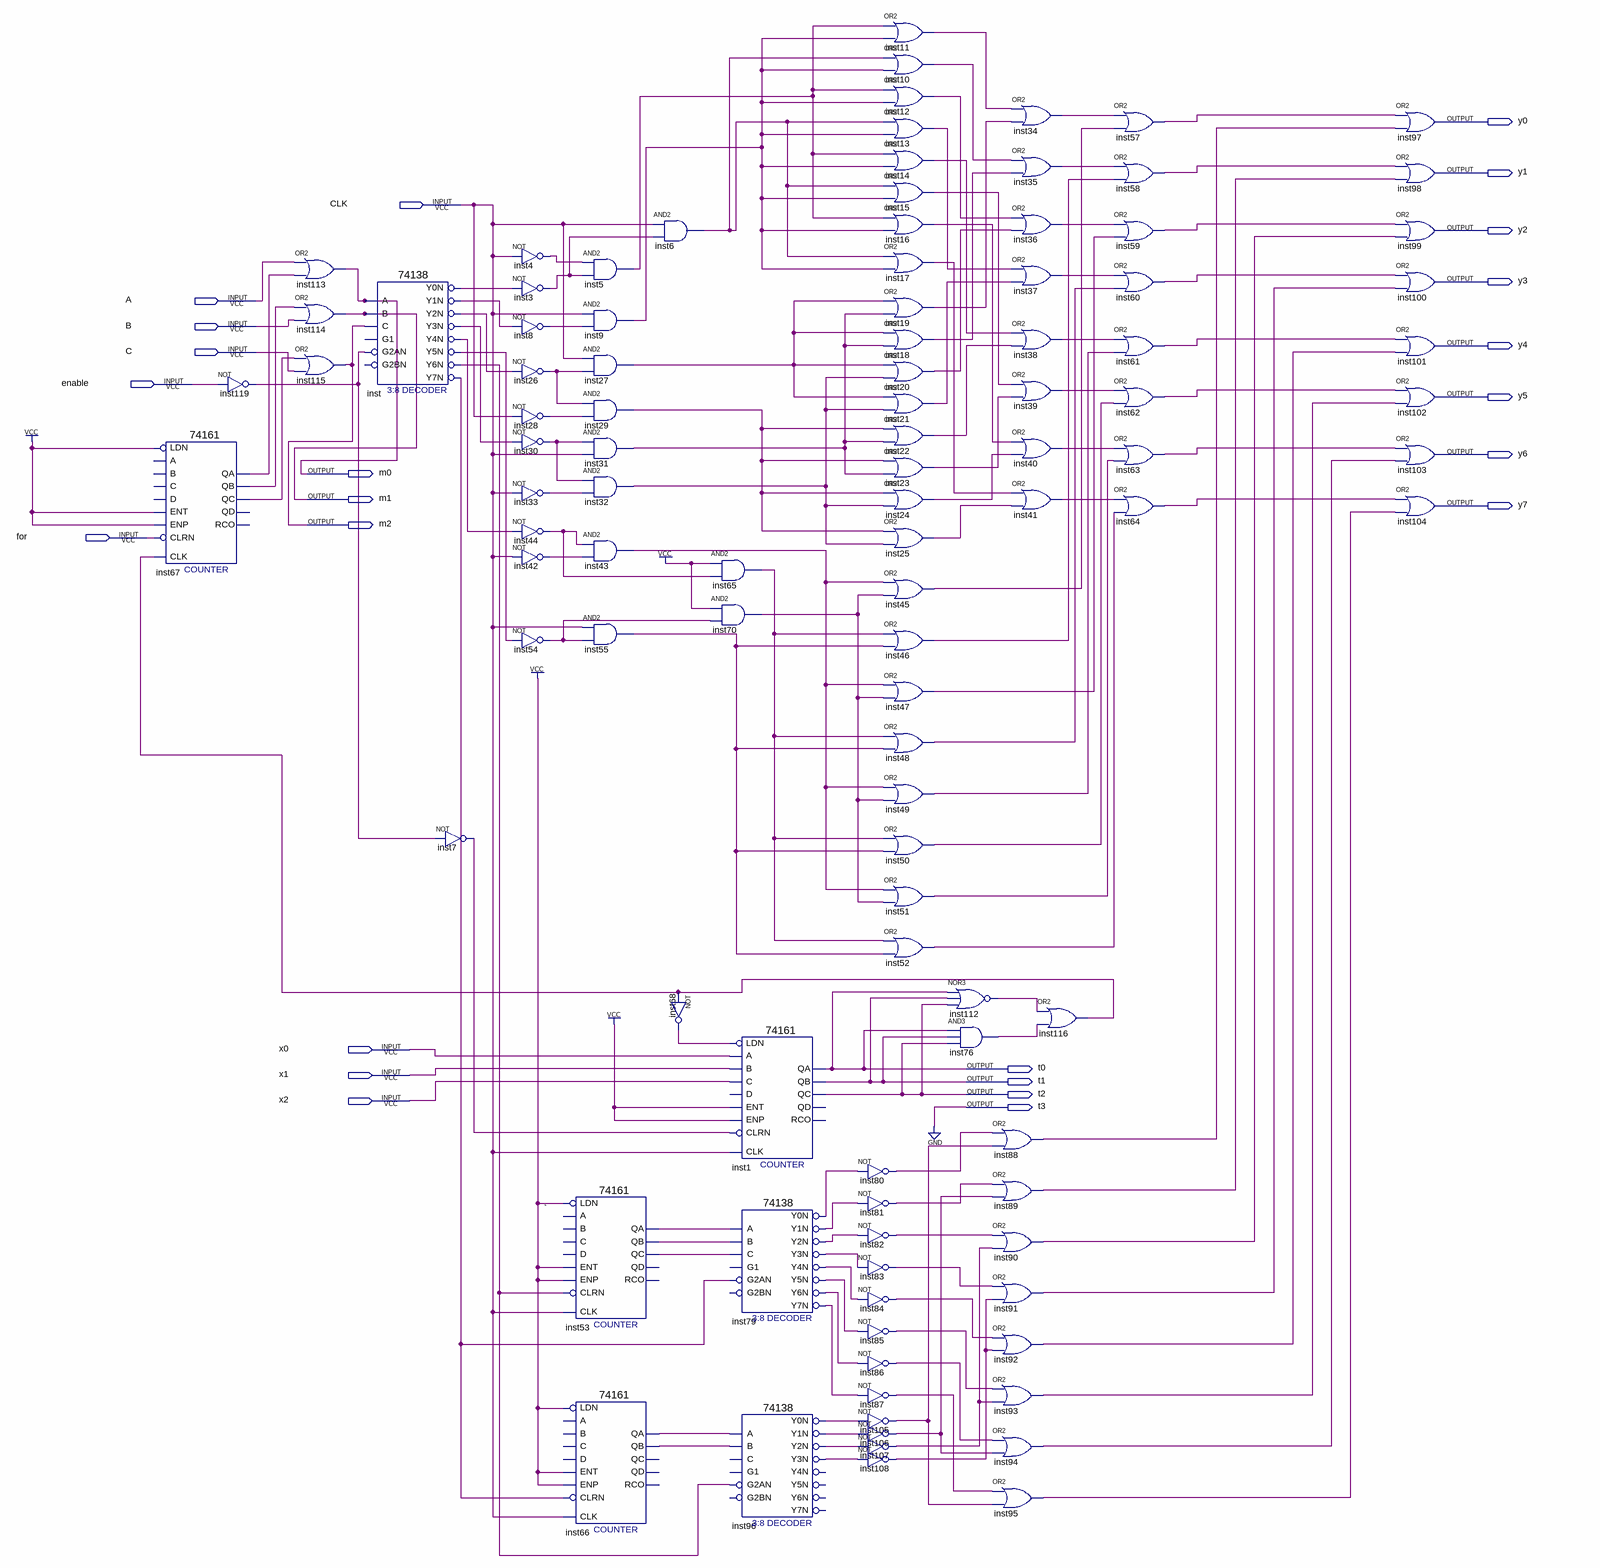
[diagram p0: schematic sheet]
// Quartus schematic HardwareBigHomework.bdf as structural Verilog: 105 symbols, 24 pins
module HardwareBigHomework (
  input  CLK,
  input  A,
  input  B,
  input  C,
  input  enable,
  input  \for ,
  input  x0,
  input  x1,
  input  x2,
  output y0,
  output y1,
  output y2,
  output y3,
  output y4,
  output y5,
  output y6,
  output m0,
  output m1,
  output y7,
  output m2,
  output t0,
  output t1,
  output t2,
  output t3
);

  wire inst3_out, inst4_out, inst5_out, inst6_out, inst7_out, inst8_out, inst9_out, inst10_out, inst11_out,
       inst12_out, inst13_out, inst14_out, inst15_out, inst16_out, inst17_out, inst18_out, inst19_out,
       inst20_out, inst21_out, inst22_out, inst23_out, inst24_out, inst25_out, inst26_out, inst27_out,
       inst28_out, inst29_out, inst30_out, inst31_out, inst32_out, inst33_out, inst34_out, inst35_out,
       inst36_out, inst37_out, inst38_out, inst39_out, inst40_out, inst41_out, inst42_out, inst43_out,
       inst44_out, inst45_out, inst46_out, inst47_out, inst48_out, inst49_out, inst50_out, inst51_out,
       inst52_out, inst53_qa, inst53_qb, inst53_qc, inst54_out, inst55_out, inst57_out, inst58_out,
       inst59_out, inst60_out, inst61_out, inst62_out, inst63_out, inst64_out, inst65_out, inst66_qa,
       inst66_qb, inst67_qa, inst67_qb, inst67_qc, inst68_out, inst70_out, inst76_out, inst79_y0n,
       inst79_y1n, inst79_y2n, inst79_y3n, inst79_y4n, inst79_y5n, inst79_y6n, inst79_y7n, inst80_out,
       inst81_out, inst82_out, inst83_out, inst84_out, inst85_out, inst86_out, inst87_out, inst88_out,
       inst89_out, inst90_out, inst91_out, inst92_out, inst93_out, inst94_out, inst95_out, inst96_y0n,
       inst96_y1n, inst96_y2n, inst96_y3n, inst105_out, inst106_out, inst107_out, inst108_out, inst112_out,
       inst116_out, inst119_out, inst_y0n, inst_y1n, inst_y2n, inst_y3n, inst_y4n, inst_y5n, inst_y6n,
       inst_y7n;

  \74161  inst67 (
    .CLRN(\for ), .CLK(inst116_out), .ENP(1'b1), .LDN(1'b1), .ENT(1'b1), .QC(inst67_qc), .QB(inst67_qb),
    .QA(inst67_qa));  // open: A, D, B, C, QD, RCO
  not inst119 (inst119_out, enable);
  or inst113 (m0, A, inst67_qa);
  or inst114 (m1, inst67_qb, B);
  or inst115 (m2, inst67_qc, C);
  \74138  inst (
    .A(m0), .B(m1), .C(m2), .G2AN(inst119_out), .Y0N(inst_y0n), .Y1N(inst_y1n), .Y2N(inst_y2n),
    .Y3N(inst_y3n), .Y4N(inst_y4n), .Y5N(inst_y5n), .Y6N(inst_y6n), .Y7N(inst_y7n));  // open: G1, G2BN
  not inst7 (inst7_out, inst119_out);
  not inst4 (inst4_out, CLK);
  not inst3 (inst3_out, inst_y0n);
  not inst8 (inst8_out, inst_y1n);
  not inst26 (inst26_out, inst_y2n);
  not inst28 (inst28_out, CLK);
  not inst30 (inst30_out, inst_y3n);
  not inst33 (inst33_out, CLK);
  not inst44 (inst44_out, inst_y4n);
  not inst42 (inst42_out, CLK);
  not inst54 (inst54_out, inst_y5n);
  \74161  inst53 (
    .CLRN(inst_y6n), .CLK(CLK), .ENP(1'b1), .LDN(1'b1), .ENT(1'b1), .QC(inst53_qc), .QB(inst53_qb),
    .QA(inst53_qa));  // open: A, D, B, C, QD, RCO
  \74161  inst66 (
    .CLRN(inst_y7n), .CLK(CLK), .ENP(1'b1), .LDN(1'b1), .ENT(1'b1), .QB(inst66_qb), .QA(inst66_qa));  // open: A, D, B, C, QD, QC, RCO
  and inst5 (inst5_out, inst4_out, inst3_out);
  and inst9 (inst9_out, CLK, inst8_out);
  and inst27 (inst27_out, CLK, inst26_out);
  and inst29 (inst29_out, inst26_out, inst28_out);
  and inst31 (inst31_out, inst30_out, CLK);
  and inst32 (inst32_out, inst30_out, inst33_out);
  and inst43 (inst43_out, inst44_out, inst42_out);
  and inst55 (inst55_out, CLK, inst54_out);
  and inst6 (inst6_out, CLK, inst3_out);
  not inst68 (inst68_out, inst116_out);
  and inst65 (inst65_out, 1'b1, inst44_out);
  and inst70 (inst70_out, 1'b1, inst54_out);
  \74161  inst1 (
    .CLRN(inst7_out), .CLK(CLK), .ENP(1'b1), .LDN(inst68_out), .A(x0), .ENT(1'b1), .B(x1), .C(x2), .QC(t2),
    .QB(t1), .QA(t0));  // open: D, QD, RCO
  \74138  inst79 (
    .A(inst53_qa), .B(inst53_qb), .C(inst53_qc), .G2AN(inst_y7n), .Y0N(inst79_y0n), .Y1N(inst79_y1n),
    .Y2N(inst79_y2n), .Y3N(inst79_y3n), .Y4N(inst79_y4n), .Y5N(inst79_y5n), .Y6N(inst79_y6n), .Y7N(inst79_y7n));  // open: G1, G2BN
  \74138  inst96 (
    .A(inst66_qa), .B(inst66_qb), .G2AN(inst_y6n), .Y0N(inst96_y0n), .Y1N(inst96_y1n), .Y2N(inst96_y2n),
    .Y3N(inst96_y3n));  // open: G1, C, G2BN, Y4N, Y5N, Y6N, Y7N
  not inst80 (inst80_out, inst79_y0n);
  not inst81 (inst81_out, inst79_y1n);
  not inst82 (inst82_out, inst79_y2n);
  not inst83 (inst83_out, inst79_y3n);
  not inst84 (inst84_out, inst79_y4n);
  not inst85 (inst85_out, inst79_y5n);
  not inst86 (inst86_out, inst79_y6n);
  not inst87 (inst87_out, inst79_y7n);
  not inst105 (inst105_out, inst96_y0n);
  not inst106 (inst106_out, inst96_y1n);
  not inst107 (inst107_out, inst96_y2n);
  not inst108 (inst108_out, inst96_y3n);
  or inst11 (inst11_out, inst5_out, inst9_out);
  or inst10 (inst10_out, inst6_out, inst9_out);
  or inst12 (inst12_out, inst5_out, inst9_out);
  or inst13 (inst13_out, inst6_out, inst9_out);
  or inst14 (inst14_out, inst5_out, inst9_out);
  or inst15 (inst15_out, inst6_out, inst9_out);
  or inst16 (inst16_out, inst5_out, inst9_out);
  or inst17 (inst17_out, inst6_out, inst9_out);
  or inst19 (inst19_out, inst27_out, inst31_out);
  or inst18 (inst18_out, inst27_out, inst31_out);
  or inst20 (inst20_out, inst27_out, inst32_out);
  or inst21 (inst21_out, inst27_out, inst32_out);
  or inst22 (inst22_out, inst29_out, inst31_out);
  or inst23 (inst23_out, inst29_out, inst31_out);
  or inst24 (inst24_out, inst29_out, inst32_out);
  or inst25 (inst25_out, inst29_out, inst32_out);
  or inst45 (inst45_out, inst43_out, inst70_out);
  or inst46 (inst46_out, inst65_out, inst55_out);
  or inst47 (inst47_out, inst43_out, inst70_out);
  or inst48 (inst48_out, inst65_out, inst55_out);
  or inst49 (inst49_out, inst43_out, inst70_out);
  or inst50 (inst50_out, inst65_out, inst55_out);
  or inst51 (inst51_out, inst43_out, inst70_out);
  or inst52 (inst52_out, inst65_out, inst55_out);
  nor inst112 (inst112_out, t0, t1, t2);
  and inst76 (inst76_out, t0, t1, t2);
  or inst34 (inst34_out, inst11_out, inst19_out);
  or inst35 (inst35_out, inst10_out, inst18_out);
  or inst36 (inst36_out, inst12_out, inst20_out);
  or inst37 (inst37_out, inst13_out, inst21_out);
  or inst38 (inst38_out, inst14_out, inst22_out);
  or inst39 (inst39_out, inst15_out, inst23_out);
  or inst40 (inst40_out, inst16_out, inst24_out);
  or inst41 (inst41_out, inst17_out, inst25_out);
  or inst88 (inst88_out, inst80_out, inst105_out);
  or inst89 (inst89_out, inst81_out, inst106_out);
  or inst90 (inst90_out, inst82_out, inst107_out);
  or inst91 (inst91_out, inst83_out, inst108_out);
  or inst92 (inst92_out, inst84_out, inst108_out);
  or inst93 (inst93_out, inst85_out, inst107_out);
  or inst94 (inst94_out, inst86_out, inst106_out);
  or inst95 (inst95_out, inst87_out, inst105_out);
  or inst116 (inst116_out, inst112_out, inst76_out);
  or inst57 (inst57_out, inst34_out, inst45_out);
  or inst58 (inst58_out, inst35_out, inst46_out);
  or inst59 (inst59_out, inst36_out, inst47_out);
  or inst60 (inst60_out, inst37_out, inst48_out);
  or inst61 (inst61_out, inst38_out, inst49_out);
  or inst62 (inst62_out, inst39_out, inst50_out);
  or inst63 (inst63_out, inst40_out, inst51_out);
  or inst64 (inst64_out, inst41_out, inst52_out);
  or inst97 (y0, inst57_out, inst88_out);
  or inst98 (y1, inst58_out, inst89_out);
  or inst99 (y2, inst59_out, inst90_out);
  or inst100 (y3, inst60_out, inst91_out);
  or inst101 (y4, inst61_out, inst92_out);
  or inst102 (y5, inst62_out, inst93_out);
  or inst103 (y6, inst63_out, inst94_out);
  or inst104 (y7, inst64_out, inst95_out);

  assign t3 = 1'b0;

  // Notes on the sheet:
  //   `
endmodule
